# EAGLE schematic UltraSoundLightConfig (EAGLE 9.6.2)
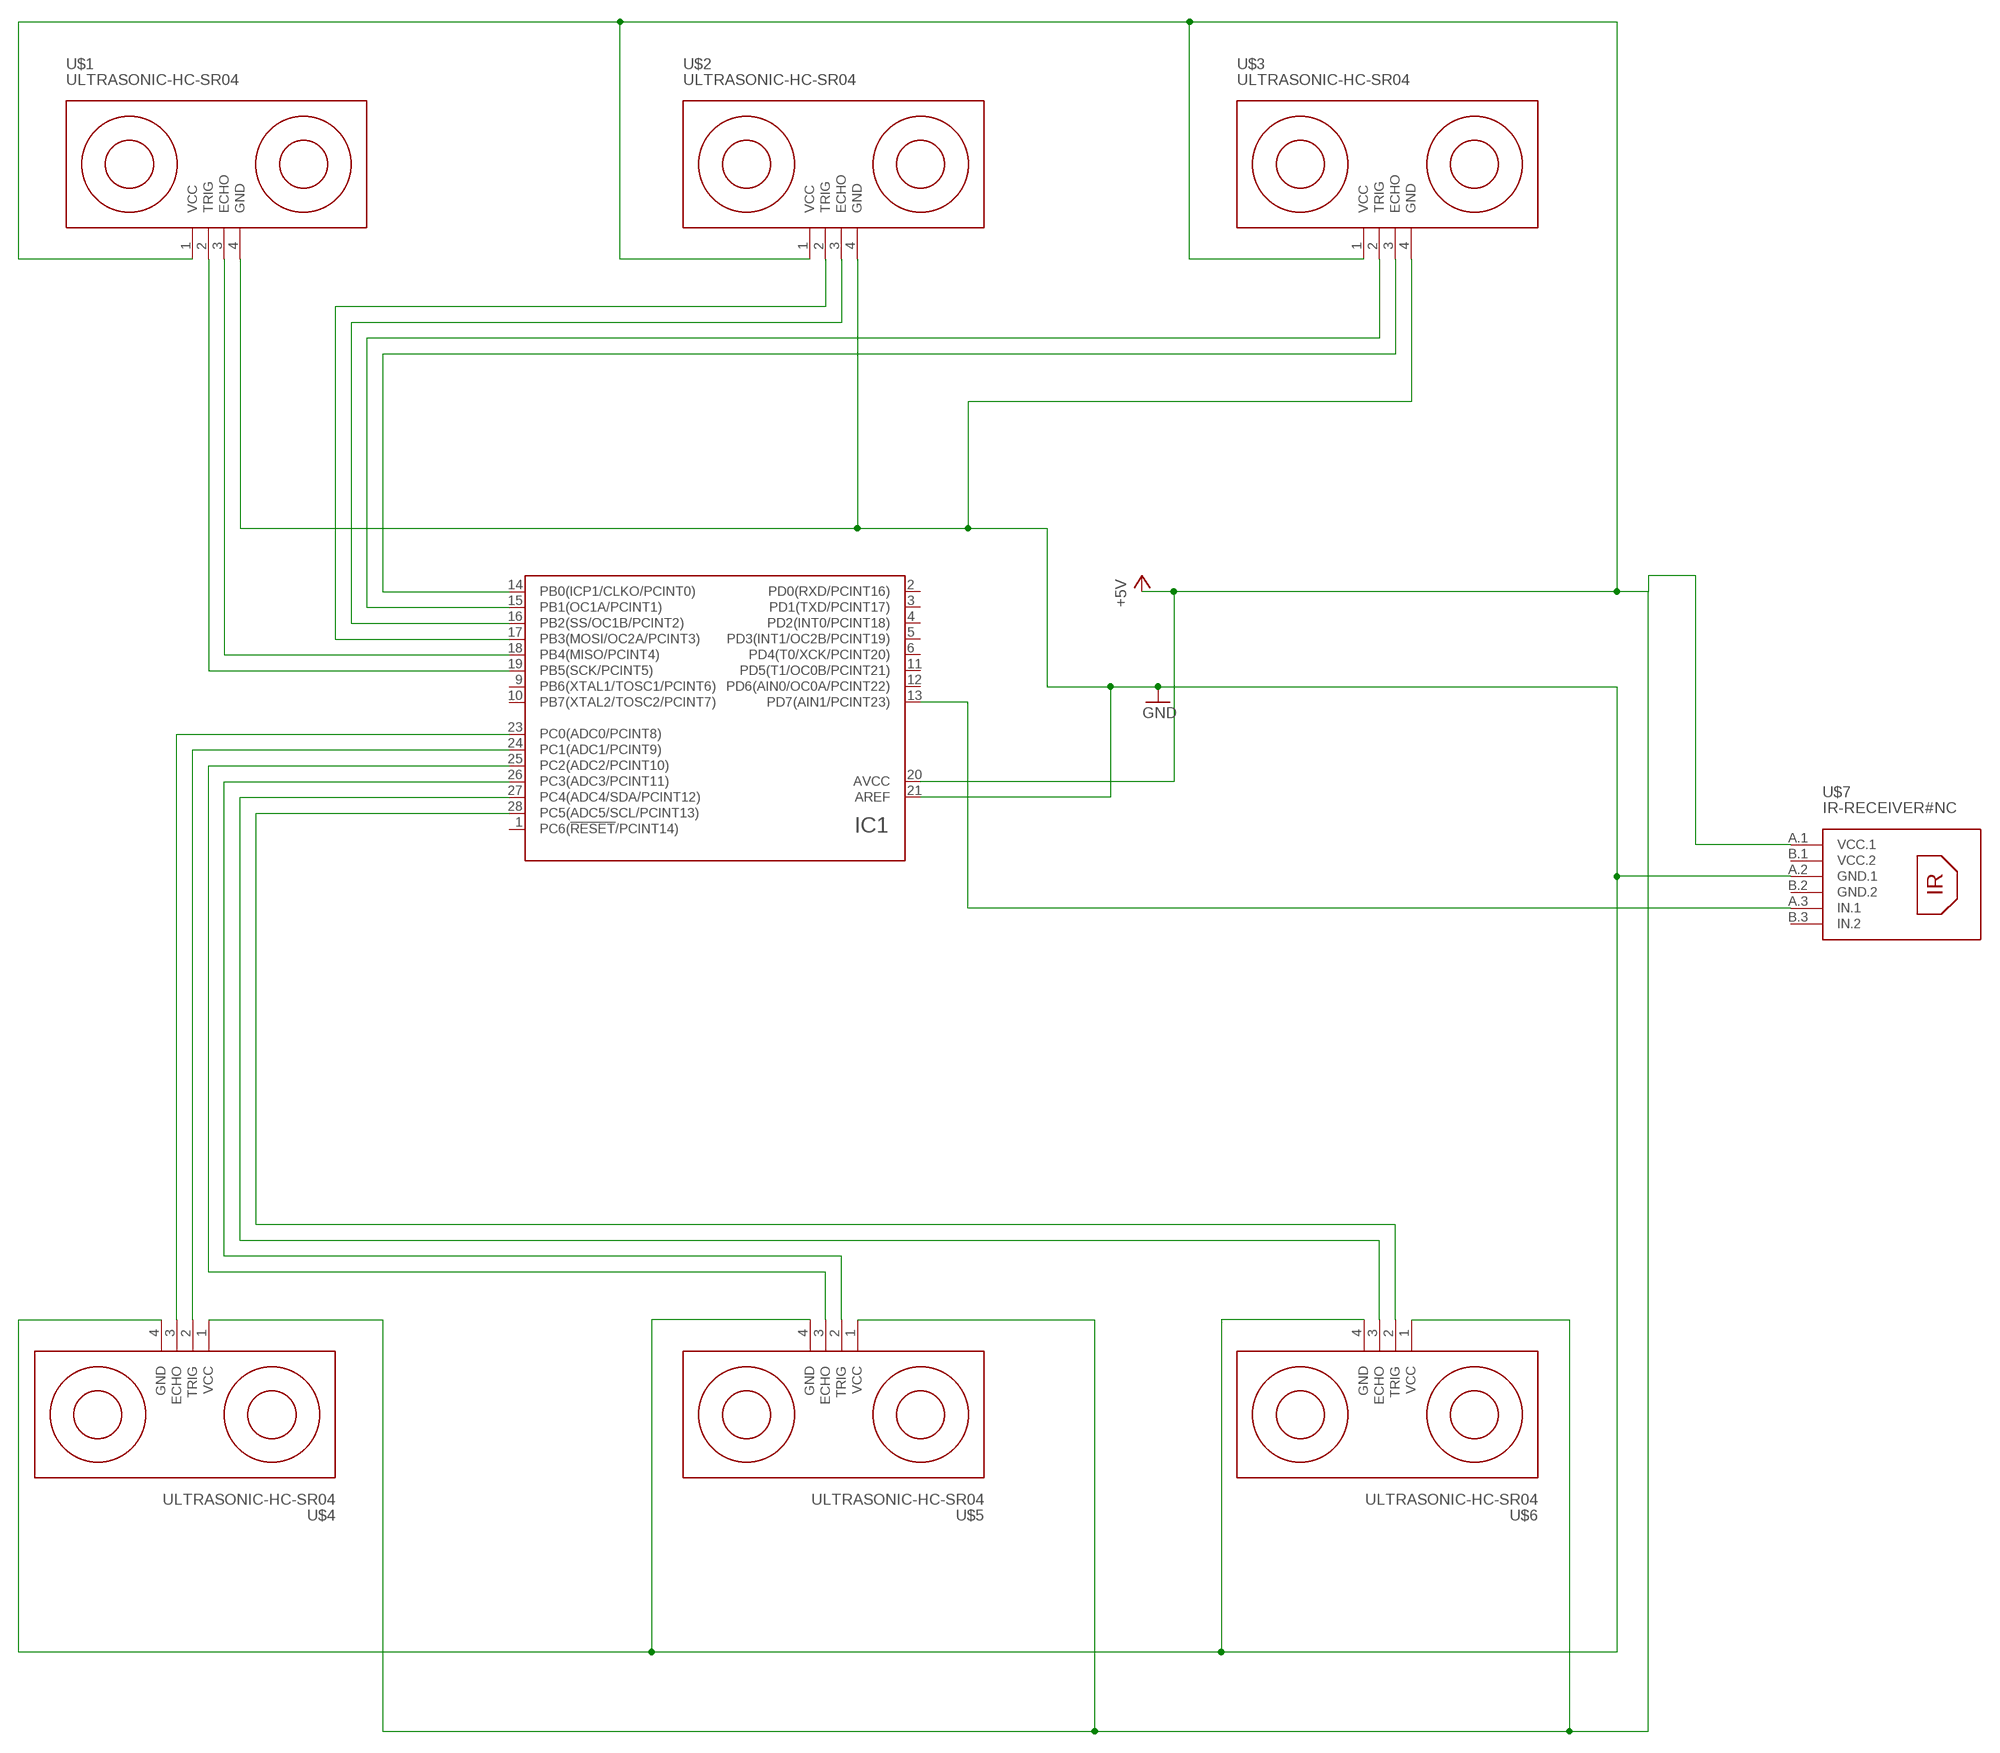
[diagram p0: schematic, sheet 1]

## Parts
IC1  ATMEGA48/88/168/328-PU(DIP28)PU  [DIL28]
U$1  ULTRASONIC-HC-SR04  [ULTRASONIC-HC-SR04]
U$2  ULTRASONIC-HC-SR04  [ULTRASONIC-HC-SR04]
U$3  ULTRASONIC-HC-SR04  [ULTRASONIC-HC-SR04]
U$4  ULTRASONIC-HC-SR04  [ULTRASONIC-HC-SR04]
U$5  ULTRASONIC-HC-SR04  [ULTRASONIC-HC-SR04]
U$6  ULTRASONIC-HC-SR04  [ULTRASONIC-HC-SR04]
U$7  IR-RECEIVER#NC  [IR-RECEIVER#NC]

## Nets
+5V: IC1.20(AVCC) U$1.1(VCC) U$2.1(VCC) U$3.1(VCC) U$4.1(VCC) U$5.1(VCC) U$6.1(VCC) U$7.A.1(VCC.1)
GND: IC1.21(AREF) U$1.4(GND) U$2.4(GND) U$3.4(GND) U$4.4(GND) U$5.4(GND) U$6.4(GND) U$7.A.2(GND.1)
N$1: IC1.19(PB5(SCK/PCINT5)) U$1.2(TRIG)
N$2: IC1.18(PB4(MISO/PCINT4)) U$1.3(ECHO)
N$3: IC1.17(PB3(MOSI/OC2A/PCINT3)) U$2.2(TRIG)
N$4: IC1.16(PB2(SS/OC1B/PCINT2)) U$2.3(ECHO)
N$5: IC1.15(PB1(OC1A/PCINT1)) U$3.2(TRIG)
N$6: IC1.14(PB0(ICP1/CLKO/PCINT0)) U$3.3(ECHO)
N$7: IC1.24(PC1(ADC1/PCINT9)) U$4.2(TRIG)
N$8: IC1.23(PC0(ADC0/PCINT8)) U$4.3(ECHO)
N$9: IC1.25(PC2(ADC2/PCINT10)) U$5.3(ECHO)
N$10: IC1.26(PC3(ADC3/PCINT11)) U$5.2(TRIG)
N$11: IC1.27(PC4(ADC4/SDA/PCINT12)) U$6.3(ECHO)
N$12: IC1.28(PC5(ADC5/SCL/PCINT13)) U$6.2(TRIG)
N$15: IC1.13(PD7(AIN1/PCINT23)) U$7.A.3(IN.1)
Unconnected: IC1.1(PC6(!RESET!/PCINT14)) IC1.2(PD0(RXD/PCINT16)) IC1.3(PD1(TXD/PCINT17)) IC1.4(PD2(INT0/PCINT18)) IC1.5(PD3(INT1/OC2B/PCINT19)) IC1.6(PD4(T0/XCK/PCINT20)) IC1.9(PB6(XTAL1/TOSC1/PCINT6)) IC1.10(PB7(XTAL2/TOSC2/PCINT7)) IC1.11(PD5(T1/OC0B/PCINT21)) IC1.12(PD6(AIN0/OC0A/PCINT22)) U$7.B.1(VCC.2) U$7.B.2(GND.2) U$7.B.3(IN.2)

## Power pins joined to a net without a drawn wire
GND: IC1.8(GND) IC1.22(GND)
UCC: IC1.7(UCC)

## Library data of the parts
IC1 = atmel_tiny24-44-84tiny48-88mega48-88-168-328:ATMEGA48/88/168/328-PU(DIP28)
U$1-U$6 = diy-modules:ULTRASONIC-HC-SR04: Ultrasonic Ranging Module HC-SR04 More details available here: http://randomnerdtutorials.com/complete-guide-for-ultrasonic-sensor-hc-sr04/ Click here to find device on ebay.com <http://www.ebay.com/sch/hc+sr04+ultrasonic>
U$7 = diy-modules:IR-RECEIVER#NC: IR Receiver Module without IR sensor connector